# Altium schematic sheet Sheet1.SchDoc
size A3; SheetNumber: 1; SheetTotal: 1
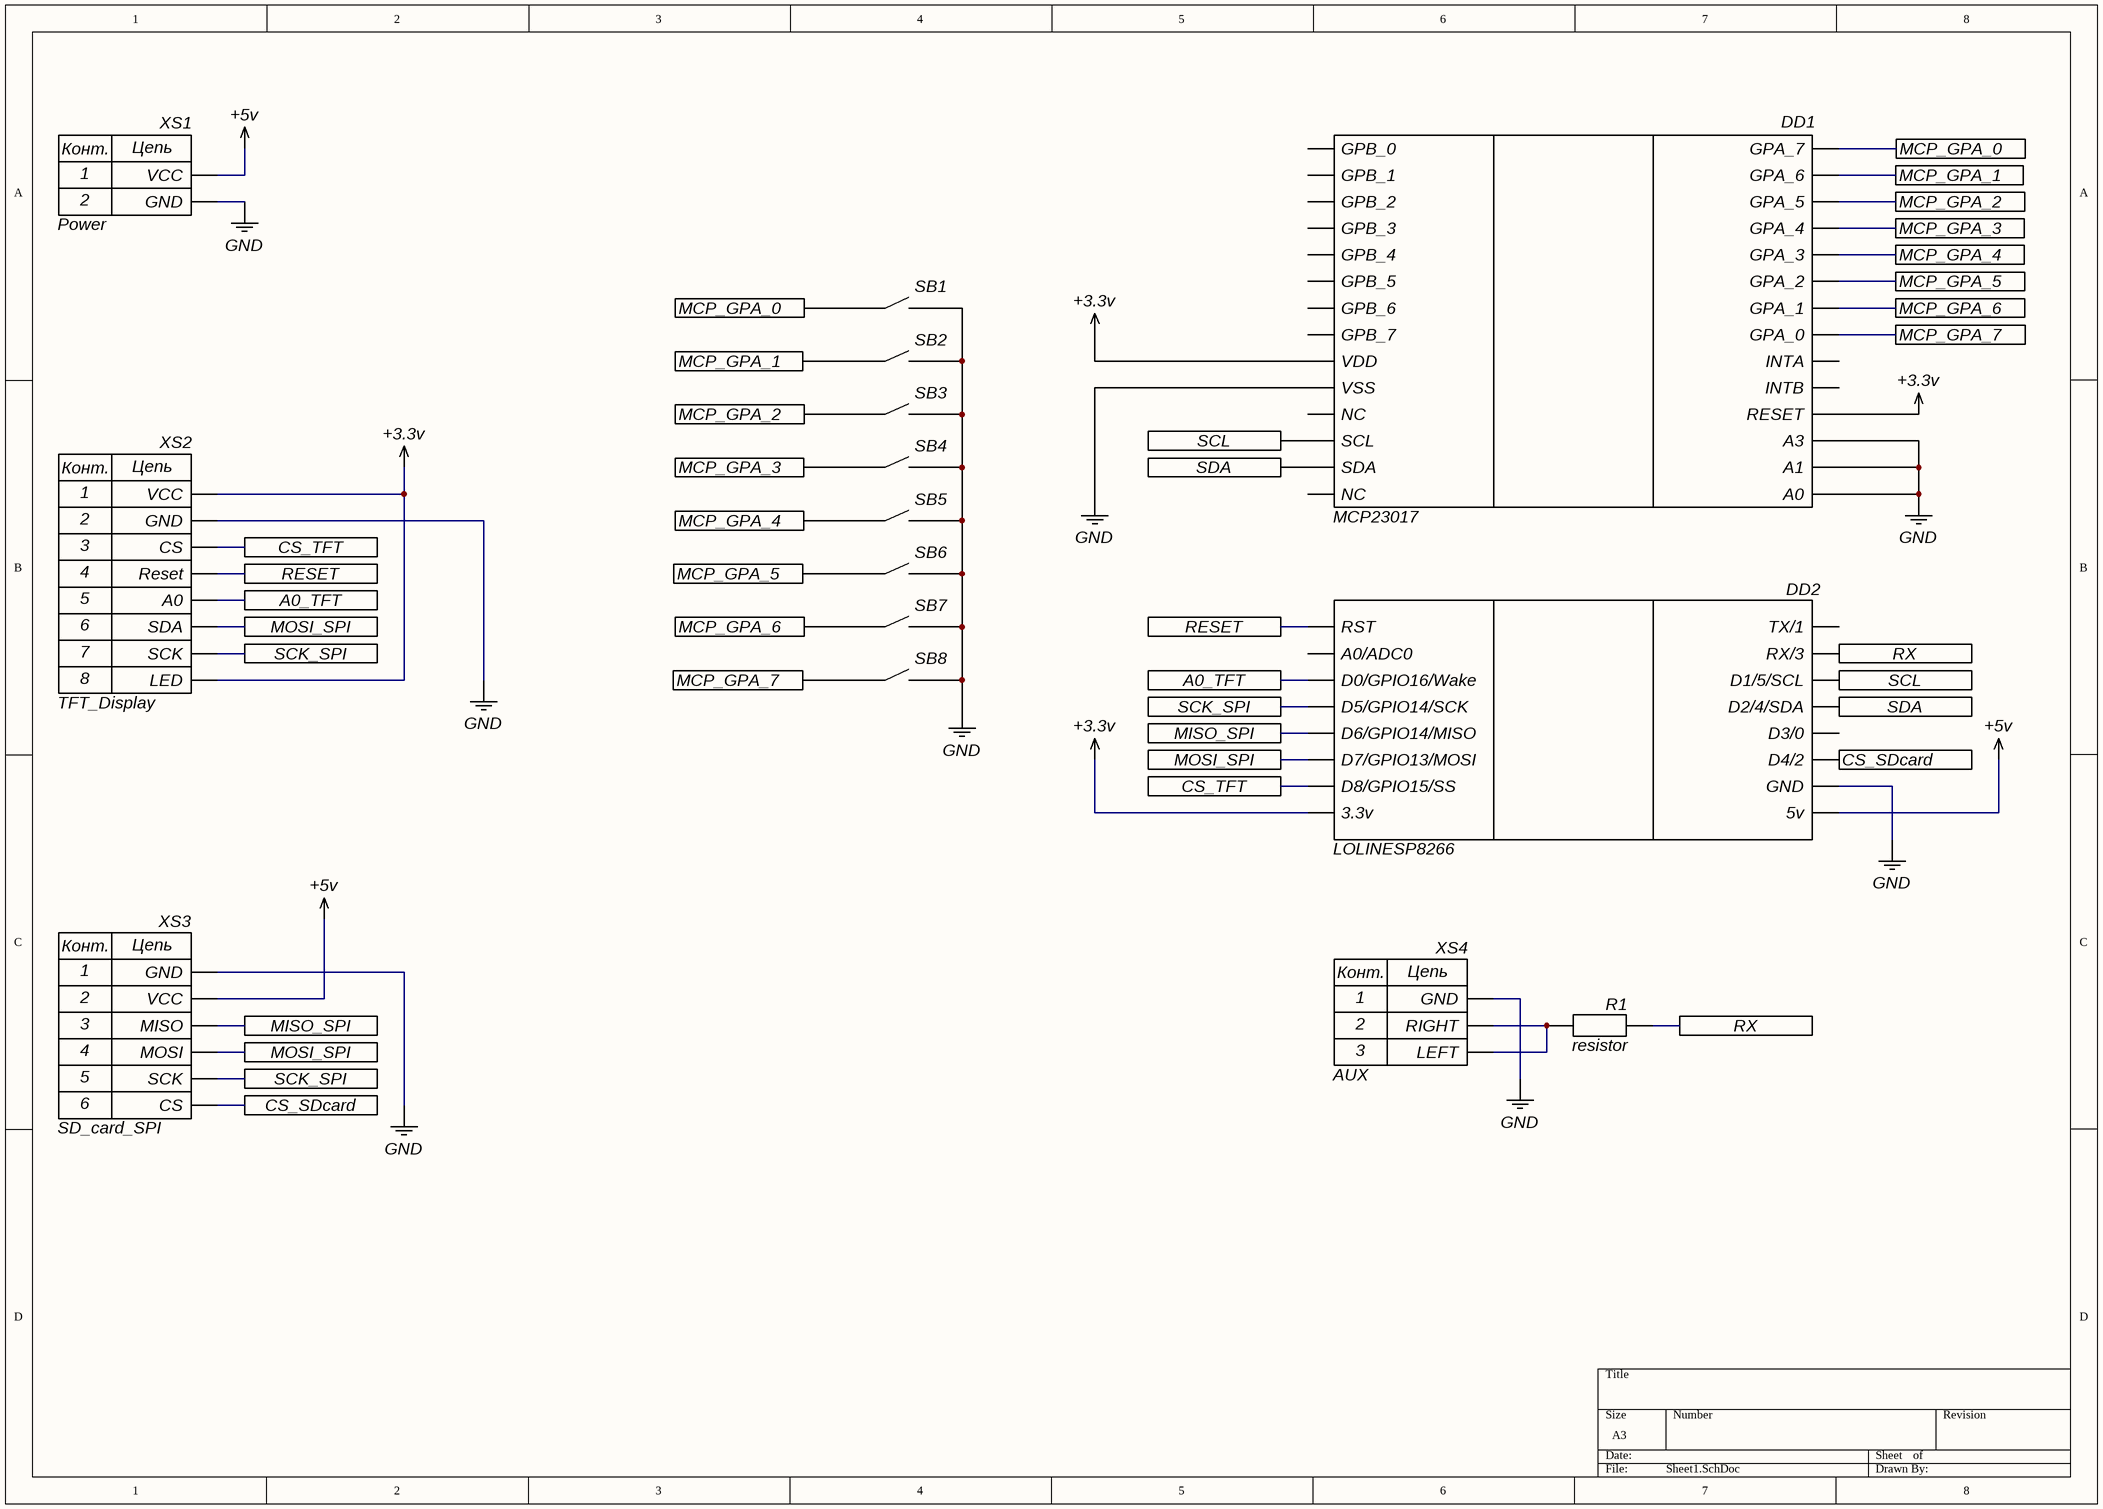
[diagram p0: Sheet1.SchDoc]

## Parts
DD1  MCP23017  [DIP28]
DD2  LOLINESP8266  [ESP8266Wemos]
R1  resistor  [res]
SB1  button  [button]  (value not drawn)
SB2  button  [button]  (value not drawn)
SB3  button  [button]  (value not drawn)
SB4  button  [button]  (value not drawn)
SB5  button  [button]  (value not drawn)
SB6  button  [button]  (value not drawn)
SB7  button  [button]  (value not drawn)
SB8  button  [button]  (value not drawn)
XS1  Power  [Power]
XS2  TFT_Display  [TFT 1.8"]
XS3  SD_card_SPI  [SDcard]
XS4  AUX  [AUX]

## Ports
A0_TFT (see Sheet1[1B]), A0_TFT (see Sheet1[5B]), CS_SDcard (see Sheet1[1C]), CS_SDcard (see Sheet1[8C]), CS_TFT (see Sheet1[1B]), CS_TFT (see Sheet1[5C]), MCP_GPA_0 (see Sheet1[3A]), MCP_GPA_0 (see Sheet1[8A]), MCP_GPA_1 (see Sheet1[3A]), MCP_GPA_1 (see Sheet1[8A]), MCP_GPA_2 (see Sheet1[3B]), MCP_GPA_2 (see Sheet1[8A]), MCP_GPA_3 (see Sheet1[3B]), MCP_GPA_3 (see Sheet1[8A]), MCP_GPA_4 (see Sheet1[3B]), MCP_GPA_4 (see Sheet1[8A]), MCP_GPA_5 (see Sheet1[3B]), MCP_GPA_5 (see Sheet1[8A]), MCP_GPA_6 (see Sheet1[3B]), MCP_GPA_6 (see Sheet1[8A]), MCP_GPA_7 (see Sheet1[3B]), MCP_GPA_7 (see Sheet1[8A]), MISO_SPI (see Sheet1[1C]), MISO_SPI (see Sheet1[5B]), MOSI_SPI (see Sheet1[1B], Sheet1[1C]), MOSI_SPI (see Sheet1[1B], Sheet1[5C]), MOSI_SPI (see Sheet1[1C], Sheet1[5C]), RESET (see Sheet1[1B]), RESET (see Sheet1[5B]), RX (see Sheet1[7C]), RX (see Sheet1[8B]), SCK_SPI (see Sheet1[1B], Sheet1[1C]), SCK_SPI (see Sheet1[1B], Sheet1[5B]), SCK_SPI (see Sheet1[1C], Sheet1[5B]), SCL (see Sheet1[5B]), SCL (see Sheet1[8B]), SDA (see Sheet1[5B]), SDA (see Sheet1[8B])

## Nets
+3.3v: DD1.9(VDD) DD1.18(RESET) DD2.8(3.3v) XS2.1(VCC) XS2.8(LED)
+5v: DD2.9(5v) XS1.1(VCC) XS3.2(VCC)
GND: DD1.10(VSS) DD1.15(A0) DD1.16(A1) DD1.17(A3) DD2.10(GND) SB1.2 SB2.2 SB3.2 SB4.2 SB5.2 SB6.2 SB7.2 SB8.2 XS1.2(GND) XS2.2(GND) XS3.1(GND) XS4.1(GND)
A0_TFT: DD2.3(D0/GPIO16/Wake) XS2.5(A0) ; port A0_TFT
CS_SDcard: DD2.11(D4/2) XS3.6(CS) ; port CS_SDcard
CS_TFT: DD2.7(D8/GPIO15/SS) XS2.3(CS) ; port CS_TFT
MCP_GPA_0: DD1.28(GPA_7) SB1.1 ; port MCP_GPA_0
MCP_GPA_1: DD1.27(GPA_6) SB2.1 ; port MCP_GPA_1
MCP_GPA_2: DD1.26(GPA_5) SB3.1 ; port MCP_GPA_2
MCP_GPA_3: DD1.25(GPA_4) SB4.1 ; port MCP_GPA_3
MCP_GPA_4: DD1.24(GPA_3) SB5.1 ; port MCP_GPA_4
MCP_GPA_5: DD1.23(GPA_2) SB6.1 ; port MCP_GPA_5
MCP_GPA_6: DD1.22(GPA_1) SB7.1 ; port MCP_GPA_6
MCP_GPA_7: DD1.21(GPA_0) SB8.1 ; port MCP_GPA_7
MISO_SPI: DD2.5(D6/GPIO14/MISO) XS3.3(MISO) ; port MISO_SPI
MOSI_SPI: DD2.6(D7/GPIO13/MOSI) XS2.6(SDA) XS3.4(MOSI) ; port MOSI_SPI
RESET: DD2.1(RST) XS2.4(Reset) ; port RESET
RX: DD2.15(RX/3) R1.2 ; port RX
SCK_SPI: DD2.4(D5/GPIO14/SCK) XS2.7(SCK) XS3.5(SCK) ; port SCK_SPI
SCL: DD1.12(SCL) DD2.14(D1/5/SCL) ; port SCL
SDA: DD1.13(SDA) DD2.13(D2/4/SDA) ; port SDA
NetR1_1: R1.1 XS4.2(RIGHT) XS4.3(LEFT)

Not connected (* = marked no-connect by the designer): DD1 1(GPB_0) 2(GPB_1) 3(GPB_2) 4(GPB_3) 5(GPB_4) 6(GPB_5) 7(GPB_6) 8(GPB_7) 11(NC) 14(NC) 19(INTB) 20(INTA); DD2 2(A0/ADC0) 12(D3/0) 16(TX/1)

## Notes on the sheet
- (in symbol AUX) Конт.; Цепь
- (in symbol Power) Конт.; Цепь
- (in symbol SD_card_SPI) Конт.; Цепь
- (in symbol TFT_Display) Конт.; Цепь